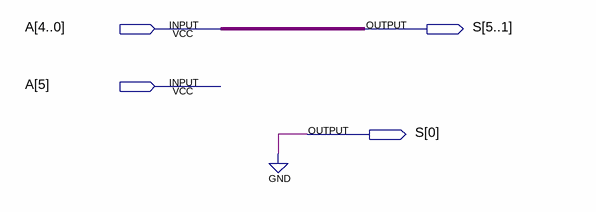
[diagram p0: schematic sheet]
// Quartus schematic g27_6bit_shift_left.bdf as structural Verilog: 0 symbols, 4 pins
module g27_6bit_shift_left (
  input  [5:0] A,
  output [5:0] S
);


  assign S = {A[4:0], 1'b0};
endmodule
